# EasyEDA schematic 1-Schematic_ACSE.json
TITLE: SMART AQUARIUM SYSTEM; REV: 1.0; Date: 2024-11-18; Sheet: 1/1; Drawn By: tharakadilshan; Company: Your Company
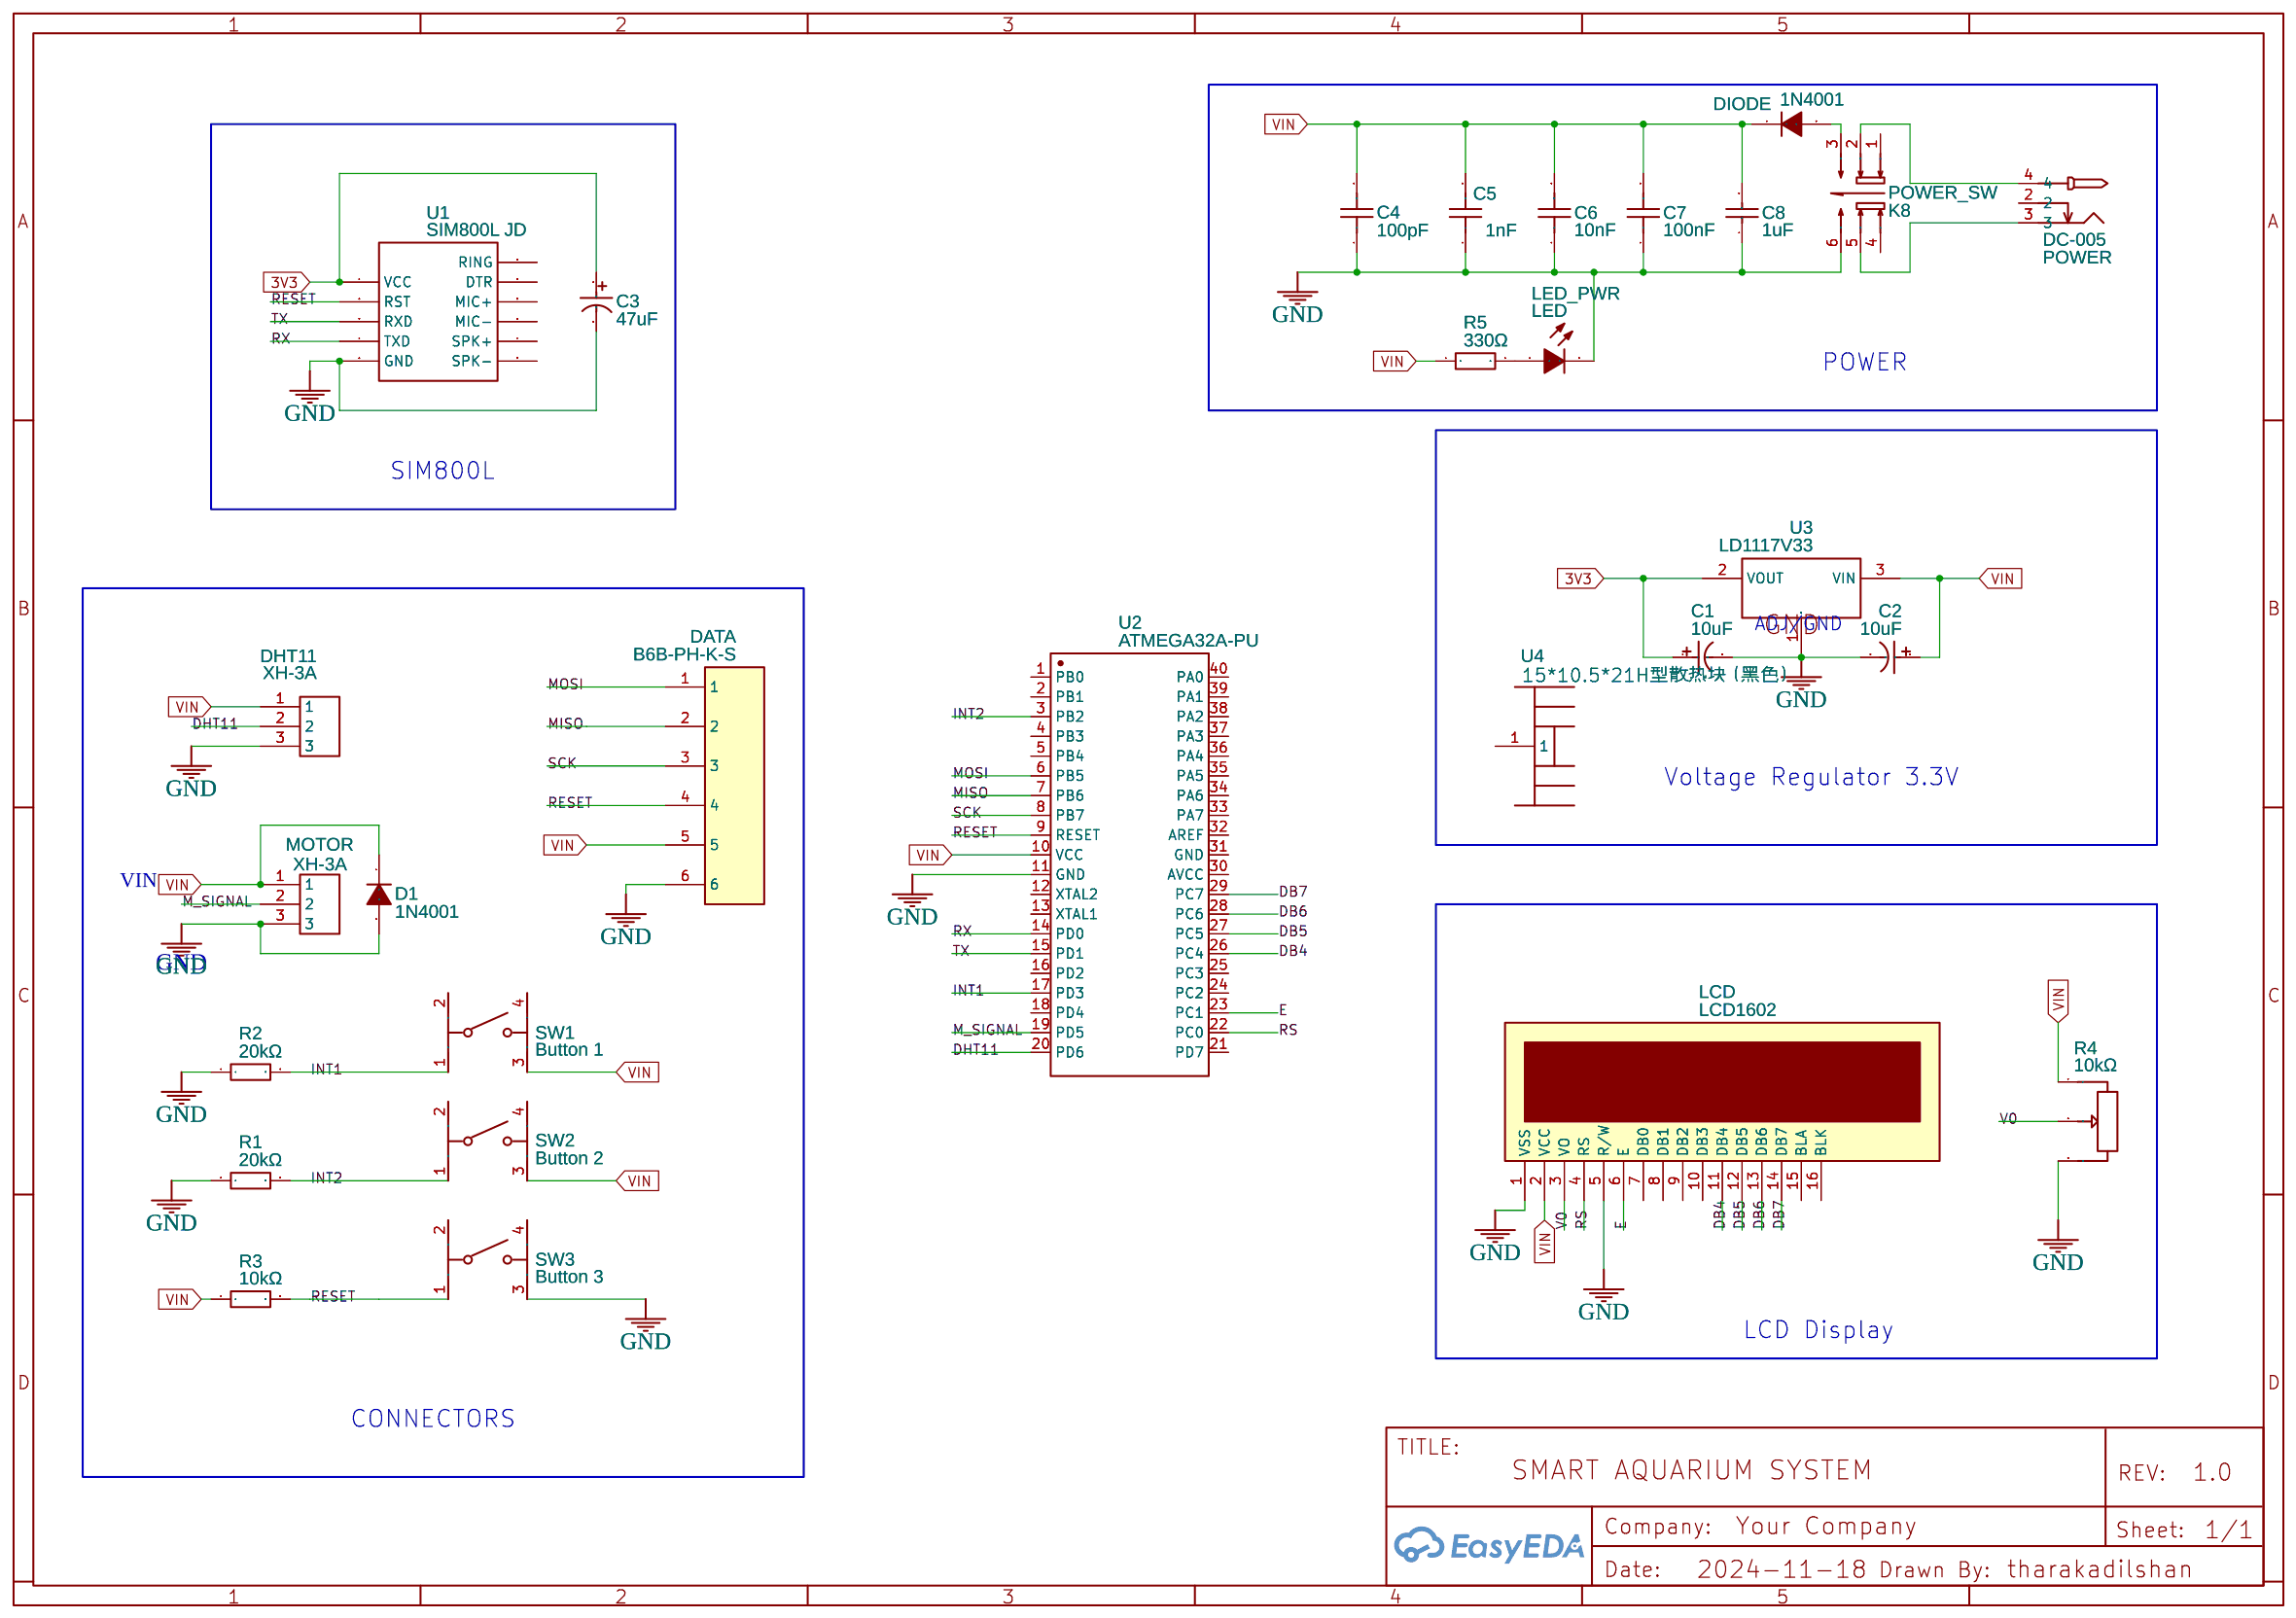
[diagram p0: schematic sheet]

## Parts
C1  10uF  [CAP-TH_BD6.3-P2.50-D1.0-FD]
C2  10uF  [CAP-TH_BD6.3-P2.50-D1.0-FD]
C3  47uF  [CAP-TH_BD5.0-P2.00-D0.8-FD]
C4  100pF  [CAP-TH_L5.0-W2.5-P5.08-D0.7]
C5  1nF  [CAP-TH_L5.0-W2.5-P5.08-D0.7]
C6  10nF  [CAP-TH_L5.0-W2.5-P5.08-D0.7]
C7  100nF  [CAP-TH_L5.0-W2.5-P5.08-D0.7]
C8  1uF  [CAP-TH_L7.6-W3.8-P5.08-D0.51]
D1  1N4001  [DO-41_BD2.4-L4.7-P8.70-D0.9-RD]
DATA  B6B-PH-K-S  [CONN-TH_B6B-PH-K-S]
DHT11  XH-3A  [CONN-TH_XH-3A]
DIODE  1N4001  [DO-41_BD2.4-L4.7-P8.70-D0.9-RD]
LCD  LCD1602  [LCD1602]
LED_PWR  LED  [LED-TH_BD3.8-P2.54-FD]
MOTOR  XH-3A  [CONN-TH_XH-3A]
POWER  DC-005  [DC-IN-TH_DC-5520-1]
POWER_SW  K8  [KEY-TH_6P-L7.0-W7.0-P2.00-LS2.0_K8-7071D-L1]
R1  20kΩ  [RES-TH_BD2.2-L6.5-P10.50-D0.6]
R2  20kΩ  [RES-TH_BD2.2-L6.5-P10.50-D0.6]
R3  10kΩ  [RES-TH_BD2.2-L6.5-P10.50-D0.6]
R4  10kΩ  [RES-ADJ-TH_CT-6EV]
R5  330Ω  [RES-TH_BD2.2-L6.5-P10.50-D0.6]
SW1  Button 1  [SW-TH_4P-L6.0-W6.0-P4.50-LS6.1]
SW2  Button 2  [SW-TH_4P-L6.0-W6.0-P4.50-LS6.1]
SW3  Button 3  [SW-TH_4P-L6.0-W6.0-P4.50-LS6.1]
U1  SIM800L JD  [SIM800L JD]
U2  ATMEGA32A-PU  [DIP-40_L52.3-W13.9-P2.54-LS15.2-BL]
U3  LD1117V33  [TO-220-3_L10.0-W4.5-P2.54-L]
U4  15*10.5*21H型散热块（黑色）  [HEATSINK-TH_L15.5-W10.5-XSD1226-005]

## Library data of the parts
C1 C2 = 10uf/100V: Supplier: LCSC; Manufacturer: CX(承兴); Manufacturer Part: KM106M100E11RR0VH2FP0; Supplier Part: C2029; JLCPCB Part Class: Extended Part
C3 = 47UF16V: Supplier: LCSC; Manufacturer: CX(承兴); Manufacturer Part: KS476M016D07RR0VH2FP0; Supplier Part: C30224; JLCPCB Part Class: Extended Part
C4 = CC1H101KC4PDSL4B30MF: Contributor: LCSC; Supplier: LCSC; Supplier Part: C254063; Manufacturer: Dersonic(德尔创); JLCPCB Part Class: Extended Part
C5 = CC1H102MC1PDB44B30MF: Contributor: LCSC; Supplier: LCSC; Supplier Part: C254065; Manufacturer: Dersonic(德尔创); JLCPCB Part Class: Extended Part
C6 = CC1H103ZC4PD3F4D30MF: Contributor: LCSC; Supplier: LCSC; Supplier Part: C254066; Manufacturer: Dersonic(德尔创); JLCPCB Part Class: Extended Part
C7 = CC1H104ZC1PD3F5P30MF: Contributor: LCSC; Supplier: LCSC; Supplier Part: C254069; Manufacturer: Dersonic(德尔创); JLCPCB Part Class: Extended Part
C8 = SR305C105KAR: Contributor: LCSC; Supplier: LCSC; Supplier Part: C444741; Manufacturer: Kyocera AVX; JLCPCB Part Class: Extended Part
D1 DIODE = 1N4001-E3/73: Contributor: LCSC; Supplier: LCSC; Manufacturer: VISHAY(威世); Supplier Part: C145491; JLCPCB Part Class: Extended Part
DATA = B6B-PH-K-S(LF)(SN): Contributor: LCSC; Supplier: LCSC; Manufacturer: JST; Supplier Part: C131342; JLCPCB Part Class: Extended Part
DHT11 MOTOR = XH-3A: Supplier: LCSC; Manufacturer: BOOMELE(博穆精密); Supplier Part: C2316; JLCPCB Part Class: Extended Part
LCD = LCD1602: Manufacturer: LONTECH(厦门龙特); Manufacturer Part: LCM1602K-NSW-BBW; Supplier Part: C83275; Supplier: LCSC; Contributor: LCEDA_Lib
LED_PWR = 204-10SDRD/S530-A3-L: Supplier: LCSC; Manufacturer: EVERLIGHT(亿光); Supplier Part: C84774; JLCPCB Part Class: Extended Part
POWER = DC-005 5.5-2.0MM: Supplier: LCSC; Manufacturer: BOOMELE(博穆精密); Manufacturer Part: DC-005 2.0; Supplier Part: C16214; JLCPCB Part Class: Extended Part
POWER_SW = K8-7071D-L1: Supplier: LCSC; Manufacturer: 韩国韩荣; Supplier Part: C111759; JLCPCB Part Class: Extended Part
R1 R2 = MFR0W4F2002A50: Supplier: LCSC; Manufacturer: UNI-ROYAL(厚声); Supplier Part: C58594; JLCPCB Part Class: Extended Part
R3 = CFR0W4J0103A50: Supplier: LCSC; Manufacturer: UNI-ROYAL(厚声); Supplier Part: C61299; JLCPCB Part Class: Extended Part
R4 = CT-6ETV 10K OHM (103): Resistance(Ohms): 10K; Contributor: LCSC; Supplier: LCSC; Supplier Part: C132860; Manufacturer: NIDEC(尼得科); JLCPCB Part Class: Extended Part
R5 = CFR0W4J0331A50: Supplier: LCSC; Manufacturer: UNI-ROYAL(厚声); Supplier Part: C61290; JLCPCB Part Class: Extended Part
SW1 = Button-6x6x6mm: Supplier Part: C71836; Supplier: LCSC; Manufacturer: BBJ; Manufacturer Part: C268224
SW2 SW3 = Button-6x6x6mm: Supplier Part: C71836; Supplier: LCSC; Manufacturer: BBJ; Manufacturer Part: Switch,6*6*6Plastic head,260G, 0.25mm,Straight line
U1 = SIM800L JD: Contributor: najmus.saqib.dhir
U2 = ATMEGA32A-PU: Supplier: LCSC; Manufacturer: MICROCHIP(美国微芯); Supplier Part: C12703; JLCPCB Part Class: Extended Part
U3 = LD1117V33: Contributor: LCSC; Supplier: LCSC; Supplier Part: C283467; Manufacturer: ST(意法半导体); JLCPCB Part Class: Extended Part
U4 = 15*10.5*21H型散热块（黑色）: Contributor: LCSC; Supplier: LCSC; Supplier Part: C116600; Manufacturer: XSD(鑫顺达); Manufacturer Part: 15*10.5*21; JLCPCB Part Class: Extended Part

## Nets
3V3: C1.1 C3.1 U1.1(VCC) U3.2(VOUT)
GND: C1.2 C2.2 C3.2 C4.1 C5.1 C6.1 C7.1 C8.1 D1.2(A) DATA.6 DHT11.3 LCD.1(VSS) LCD.5(R/W) LED_PWR.2(C) MOTOR.3 POWER_SW.6 R1.1 R2.1 R4.3 SW3.3 U1.5(GND) U2.11(GND) U3.1(GND)
V0: LCD.3(VO) R4.2
VIN: C2.1 C4.2 C5.2 C6.2 C7.2 C8.2 D1.1(K) DATA.5 DHT11.1 DIODE.1(K) LCD.2(VCC) MOTOR.1 R3.1 R4.1 R5.1 SW1.3 SW2.3 U2.10(VCC) U3.3(VIN)
DB4: LCD.11(DB4) U2.26(PC4)
DB5: LCD.12(DB5) U2.27(PC5)
DB6: LCD.13(DB6) U2.28(PC6)
DB7: LCD.14(DB7) U2.29(PC7)
DHT11: DHT11.2 U2.20(PD6)
E: LCD.6(E) U2.23(PC1)
INT1: R2.2 SW1.1 U2.17(PD3)
INT2: R1.2 SW2.1 U2.3(PB2)
M_SIGNAL: MOTOR.2 U2.19(PD5)
MISO: DATA.2 U2.7(PB6)
MOSI: DATA.1 U2.6(PB5)
RESET: DATA.4 R3.2 SW3.1 U1.2(RST) U2.9(RESET)
RS: LCD.4(RS) U2.22(PC0)
RX: U1.4(TXD) U2.14(PD0)
SCK: DATA.3 U2.8(PB7)
TX: U1.3(RXD) U2.15(PD1)
Net-(DIODE-2): DIODE.2(A) POWER_SW.3
Net-(LED_PWR-1): LED_PWR.1(A) R5.2
Net-(POWER-3): POWER.3 POWER_SW.5
Net-(POWER-4): POWER.4 POWER_SW.2

Not connected (* = marked no-connect by the designer): LCD 7(DB0) 8(DB1) 9(DB2) 10(DB3) 15(BLA) 16(BLK); POWER 2; POWER_SW 1 4; SW1 2 4; SW2 2 4; SW3 2 4; U1 6(SPK-) 7(SPK+) 8(MIC-) 9(MIC+) 10(DTR) 11(RING); U2 1(PB0) 2(PB1) 4(PB3) 5(PB4) 12(XTAL2) 13(XTAL1) 16(PD2) 18(PD4) 21(PD7) 24(PC2) 25(PC3) 30(AVCC) 31(GND) 32(AREF) 33(PA7) 34(PA6) 35(PA5) 36(PA4) 37(PA3) 38(PA2) 39(PA1) 40(PA0); U4 1

## Notes on the sheet
- POWER
- SIM800L
- ADJ/GND
- Voltage Regulator 3.3V
- VIN
- GND
- LCD Display
- CONNECTORS
